# Altium schematic sheet JTAG.SchDoc
size A4
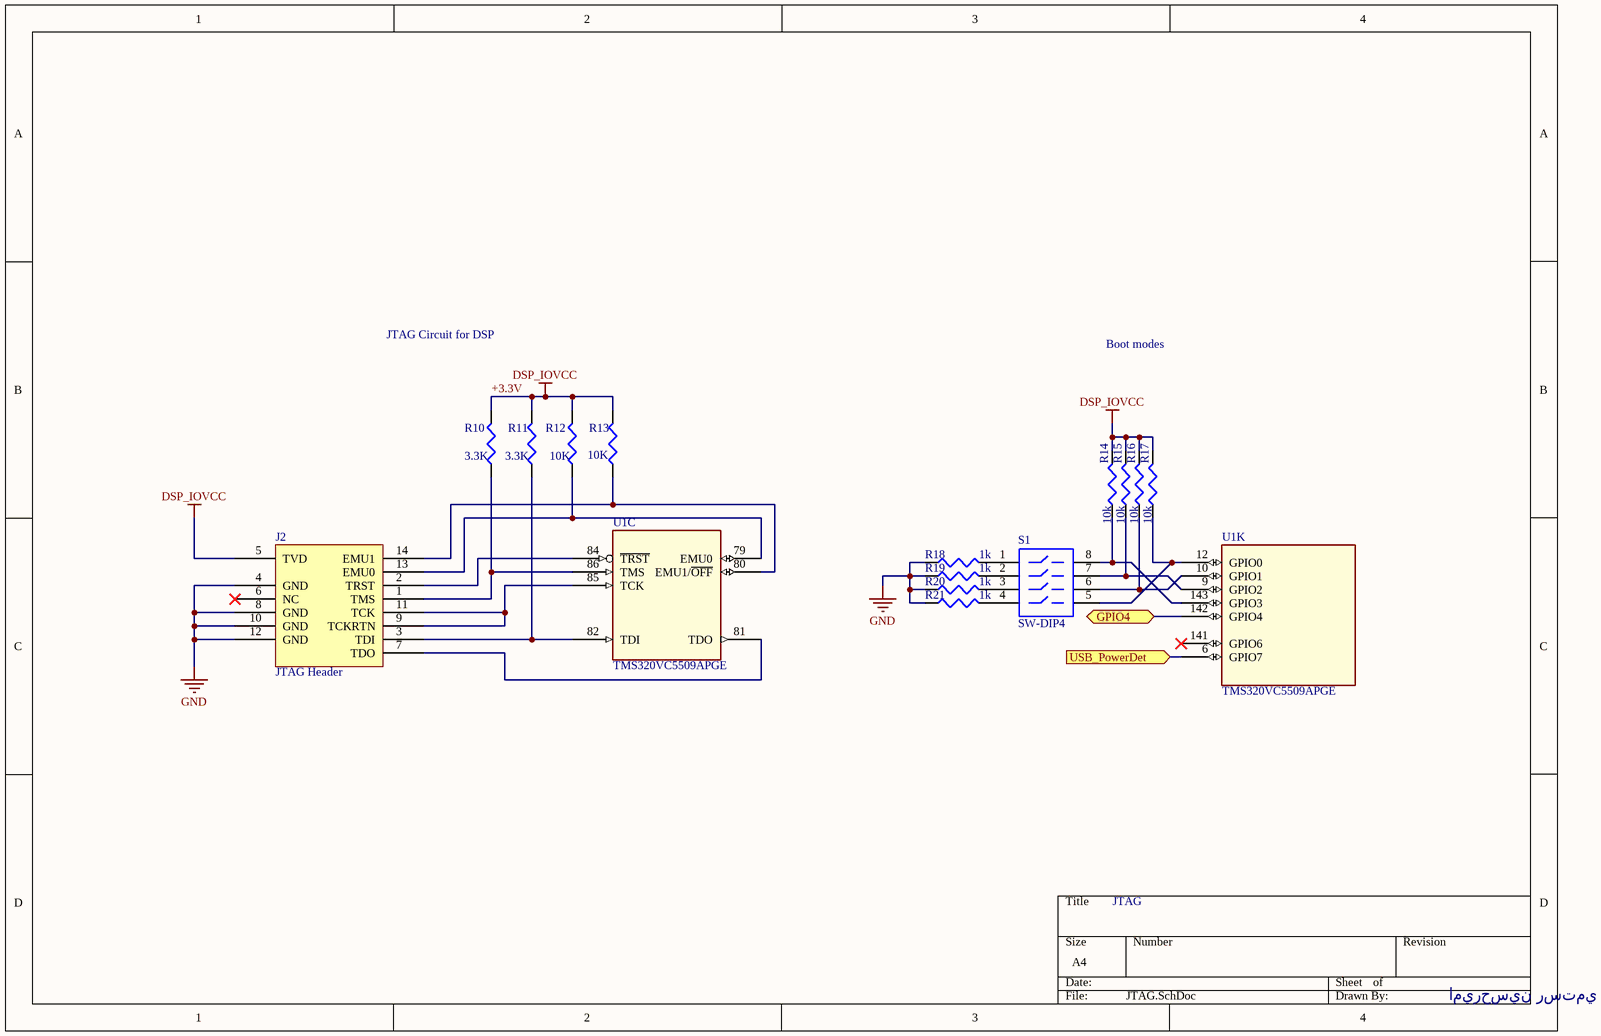
[diagram p0: JTAG.SchDoc]

## Parts
J2  JTAG Header  [HDR2X7]
R10  3.3k  [J1-0603]
R11  3.3k  [J1-0603]
R12  10k  [J1-0603]
R13  10k  [J1-0603]
R14  10k  [J1-0603]
R15  10k  [J1-0603]
R16  10k  [J1-0603]
R17  10k  [J1-0603]
R18  1k  [J1-0603]
R19  1k  [J1-0603]
R20  1k  [J1-0603]
R21  1k  [J1-0603]
S1  SW-DIP4  [DIP-8]
U1  TMS320VC5509APGE  [TMSVC5509APGA]  (parts C,K of 16)

## Ports
GPIO4, USB_PowerDet (in)

## Nets
+3.3V: J2.5(TVD) R10.2 R11.2 R12.2 R13.2 R14.2 R15.2 R16.2 R17.2  [also labelled DSP_IOVCC]
GND: J2.4(GND) J2.8(GND) J2.10(GND) J2.12(GND) R18.1 R19.1 R20.1 R21.1
GPIO4: U1.142(GPIO4) ; port GPIO4
USB_PowerDet: U1.6(GPIO7) ; port USB_PowerDet
NetJ2_1: J2.1(TMS) R10.1 U1.86(TMS)
NetJ2_2: J2.2(TRST) U1.84(~{TRST})
NetJ2_3: J2.3(TDI) R11.1 U1.82(TDI)
NetJ2_7: J2.7(TDO) U1.81(TDO)
NetJ2_9: J2.9(TCKRTN) J2.11(TCK) U1.85(TCK)
NetJ2_13: J2.13(EMU0) R12.1 U1.79(EMU0)
NetJ2_14: J2.14(EMU1) R13.1 U1.80(EMU1/~{OFF})
NetR14_1: R14.1 S1.8 U1.143(GPIO3)
NetR15_1: R15.1 S1.7 U1.9(GPIO2)
NetR16_1: R16.1 S1.6 U1.10(GPIO1)
NetR17_1: R17.1 S1.5 U1.12(GPIO0)
NetR18_2: R18.2 S1.1
NetR19_2: R19.2 S1.2
NetR20_2: R20.2 S1.3
NetR21_2: R21.2 S1.4

Not connected (* = marked no-connect by the designer): J2 6(NC)*; U1 141(GPIO6)*

## Notes on the sheet
- JTAG Circuit for DSP
- Boot modes
- JTAG
- اميرحسين رستمي

## Library data of the parts
J2 = JTAG Header: JTAG Header for DSP 5509
R10-R21 = Res3: Resistor; Published: 8-Jun-2000; LatestRevisionDate: 04-Mar-2005; LatestRevisionNote: PCB Footprint replaced.; PackageReference: J1-0603; Publisher: Altium Limited
  R10 R11: Value: 3.3K
  R12 R13: Value: 10K
  R14-R17: Value: 10k
  R18-R21: Value: 1k
S1 = SW-DIP4: DIP Switch; Published: 24-Mar-1999; LatestRevisionDate: 17-Jul-2002; LatestRevisionNote: Re-released for DXP Platform.; PackageReference: DIP-8; Publisher: Altium Limited